# Altium schematic sheet Power Schematic.SchDoc
size A4; SheetNumber: 2; SheetTotal: 3
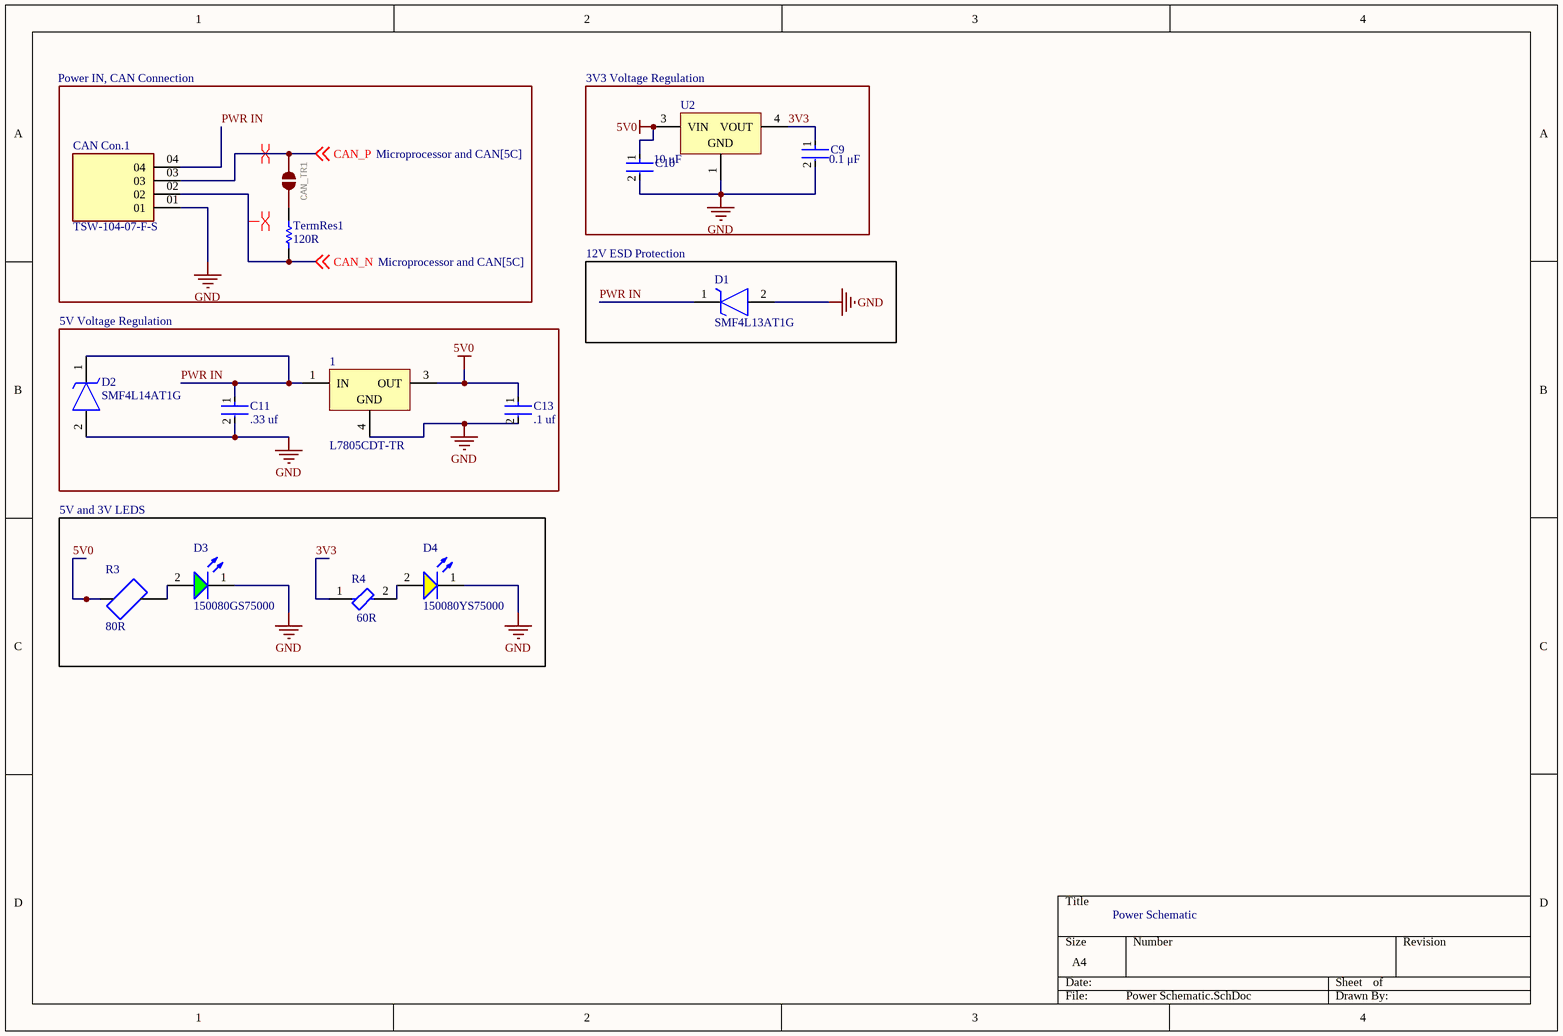
[diagram p0: Power Schematic.SchDoc]

## Parts
1  L7805CDT-TR  [TO-252_N]
C9  C0805C106K8PACTU  [FP-C0805C-DG-MFG]  (value not drawn)
C10  08051C104K4T2A  [FP-0805-L_2_01_0_2-W_1_25-IPC_B]  (value not drawn)
C11  .33 uf  [FP-GCJ219-0_3-IPC_A]
C13  .1 uf  [FP-0805-L_2_01_0_2-W_1_25-IPC_B]
CAN_Con.1  TSW-104-07-F-S  [SAMTEC_TSW-104-07-F-S]
CAN_TR1  (no value)  [SMT-JUMPER_2_NO_SILK]
D1  SMF4L13AT1G  [SODFL3619X98N]
D2  SMF4L14AT1G  [SODFL3619X98N]
D3  150080GS75000  [WL-SMCW_0805_150080xx75000]
D4  150080YS75000  [WL-SMCW_0805_150080xx75000]
R3  80R  [FB_HI0805R800R-10]
R4  60R  [FP-BLM21-0_2-t0_85-e0_5-d-IPC_A]
TermRes1  120R  [RESC2013X60X40LL20T25]
U2  LD1117ADT33TR  [TO-252_L]  (value not drawn)

## Blocks framed on the sheet
Power IN, CAN Connection: CAN_Con.1 CAN_TR1 TermRes1
12V ESD Protection: D1
5V Voltage Regulation: 1 C11 C13 D2
5V and 3V LEDS: D3 D4 R3 R4

## Nets
5V0: 1.3(OUT) C10.1 C13.1 R3.1 U2.3(VIN)
GND: 1.4(GND) C9.2 C10.2 C11.2 C13.2 CAN_Con.1.01 D1.2(A) D2.2(A) D3.1(K) D4.1(K) U2.1(GND)
3V3: C9.1 R4.1 U2.4(VOUT)
CAN_N: CAN_Con.1.02 TermRes1.1 ; off-sheet CAN_N
CAN_P: CAN_Con.1.03 CAN_TR1.1 ; off-sheet CAN_P
PWR IN: 1.1(IN) C11.1 CAN_Con.1.04 D1.1(K) D2.1(K)
NetCAN_TR1_2: CAN_TR1.2 TermRes1.2
NetD3_2: D3.2(A) R3.2
NetD4_2: D4.2(A) R4.2

## Layout directives
differential pair: CAN_N, CAN_P

## Notes on the sheet
- (near U2) 3V3 Voltage Regulation
- (near U2) 10 μF
- (near C9) 0.1 μF
- Power Schematic

## Library data of the parts
1 = CMP-0244-00216-1: Positive Voltage Regulator, 3-Pin DPAK, Tape and Reel; PackageVersion: 2011; PackageReference: TO-252; DatasheetVersion: 16/11/2011; PackageDescription: 3-Pin Transistor Outline Package 2.28 mm Pitch, 9.7 mm Lead Span (DPAK); ComponentLink1URL: http://www.st.com; ComponentLink2Description: Datasheet; ComponentLink1Description: Manufacturer URL; ComponentLink2URL: http://www.st.com/internet/com/TECHNICAL_RESOURCES/TECHNICAL_LITERATURE/DATASHEET/CD00000444.pdf
C9 = CMP-2007-03243-2: CAP CER 10UF 10V X5R 0805; Manufacturer: Kemet; 3DS Part Number: 220-00001; Tolerance: 10%; Temperature Coefficient: 15%; Material: Ceramic; Device Class L2: Capacitors; Device Class L1: Passive Components; ComponentLink2URL: https://content.kemet.com/datasheets/KEM_C1006_X5R_SMD.pdf; Height: 1.4mm; Lead Free: Yes; Manufacturer Part Number: C0805C106K8PACTU; Digikey Description: CAP CER 10UF 10V X5R 0805; Octopart: https://octopart.com/c0805c106k8pactu-kemet-98697; Capacitance: 10uF; Value: 10uF; Temperature Range Low: -55°C; Temperature: -55°C to +85°C; Automotive: No; Mouser Description: CAP CER 10UF 10V X5R 0805; Ipc Land Pattern Name: CAPC200125X125; Temperature Range High: +85°C; Voltage: 10V; RoHS: TRUE; Device Class L3: Ceramic Capacitors; ComponentLink2Description: Datasheet; Voltage Rating: 10V; Package: C0805C-DG; Temperature Characteristic: X5R; Category: Cap
C10 = CMP-2007-04172-2: Automotive Ceramic Capacitor, 0805, 100nF, 10%, X7R, 15%, 100V; Voltage Rating (DC): 100V; Case Code (Metric): 2012; Mount: Surface Mount; Length: 2.01mm; Depth: 1.25mm; Lead Free: Lead Free; Ratings: AEC-Q200; Max Operating Temperature: 125°C; Tolerance: 10%; Case/Package: 0805; Width: 0.049inch; Package Quantity: 1; Thickness: 0.055inch; Construction: Flat; Min Operating Temperature: -55°C; REACH SVHC: No SVHC; Number of Pins: 2; Radiation Hardening: No; Capacitance: 100nF; Voltage Rating: 100V; Height: 1.4mm; Series: -; Voltage: 100V; Dielectric: X7R; Termination: SMD/SMT; Case Code (Imperial): 0805; RoHS Compliant: Yes; Packaging: Tape and Reel; Dielectric Material: Ceramic
C11 = CMP-06035-047295-1: Cap Ceramic Multilayer 0.33uF 50VDC 10% SMD Paper T/R; Capacitance: 330nF; Voltage Rating (DC): 50V; Dielectric: X7R; Tolerance: 10%; Case/Package: 0805; Lead Free: Lead Free
C13 = CMP-2007-04174-2: General Purpose Ceramic Capacitor, 0805, 100nF, 10%, X7R, 15%, 100V; Packaging: Tape and Reel; Min Operating Temperature: -55°C; Dielectric Material: Ceramic; Height: 1.4mm; Voltage Rating: 100V; Termination: SMD/SMT; Case Code (Imperial): 0805; Case Code (Metric): 2012; Case/Package: 0805; Construction: Flat; Radiation Hardening: No; Series: -; Dielectric: X7R; Package Quantity: 2000; Mount: Surface Mount; Capacitance: 100nF; Contact Plating: Tin; Voltage: 100V; Lead Free: Lead Free; Depth: 1.25mm; RoHS Compliant: Yes; Number of Pins: 2; Max Operating Temperature: 125°C; Length: 2.01mm; Voltage Rating (DC): 100V; Thickness: 0.055inch; REACH SVHC: No SVHC; Width: 0.049inch; Tolerance: 10%
CAN_Con.1 = TSW-104-07-F-S: MF: Samtec; MP: TSW-104-07-F-S; Price: None; Package: None; Availability: Unavailable; Value: *; Supplier 1: Digikey; Supplier Part Number 1: MTSW-104-07-F-S-170-ND
CAN_TR1 = JUMPER-SMT_2_NO_SILK: GateName_1: G$1; SymbolName_1: SMT-JUMPER_2_NO; DeviceName: _SILK; LibraryName: SparkFun-Jumpers; DeviceSetName: JUMPER-SMT_2_NO; Package: SMT-JUMPER_2_NO_SILK
D1 = SMF4L13AT1G: TVS Diode (Uni-directional); Manufacturer_Name: LITTELFUSE; Datasheet Link: https://www.littelfuse.com/media?resourcetype=datasheets&itemid=f093622a-2591-4e70-85e6-32321d2f8c5a&filename=tvs-diode-smf4l-t1g-datasheet; Height: 0.98mm; Manufacturer_Part_Number: SMF4L13AT1G; Mouser Part Number: 576-SMF4L13AT1G; Mouser Price/Stock: https://www.mouser.co.uk/ProductDetail/Littelfuse/SMF4L13AT1G?qs=OcgtsXO%252B3gst%2FkI5Xf9O6g%3D%3D
D2 = SMF4L14AT1G: TVS Diode (Uni-directional); Manufacturer_Name: LITTELFUSE; Datasheet Link: https://www.littelfuse.com/media?resourcetype=datasheets&itemid=f093622a-2591-4e70-85e6-32321d2f8c5a&filename=tvs-diode-smf4l-t1g-datasheet; Height: 0.98mm; Manufacturer_Part_Number: SMF4L14AT1G; Mouser Part Number: 576-SMF4L14AT1G; Mouser Price/Stock: https://www.mouser.co.uk/ProductDetail/Littelfuse/SMF4L14AT1G?qs=OcgtsXO%252B3gvCCebw4hBNNg%3D%3D
D3 = CMP-1426-00007-3: WURTH ELEKTRONIK - 150080GS75000 - LED, Green, SMD, 0805, 30 mA, 3.2 V, 520 nm; Forward Voltage: 3.2V; Viewing Angle: 140°; Power Dissipation: 105mW; Peak Wavelength: 515nm; Max Reverse Voltage (DC): 5V; Luminous Intensity: 450mcd; Wavelength: 525nm; Max Junction Temperature (Tj): 95°C; Forward Current: 100mA; Test Current: 20mA; Lens Style: Clear, Rectangular; Length: 2mm; Case/Package: 0805; Case Code (Metric): 2012; Color: Green; Height: 700µm; Width: 1.25mm; Packaging: Tape and Reel; Mount: Surface Mount; REACH SVHC: Unknown; RoHS: Compliant; Min Operating Temperature: -40°C; Reverse Voltage: 5V; Max Operating Temperature: 85°C; Dominant Wavelength: 525nm; Case Code (Imperial): 0805
D4 = CMP-1426-00012-3: 2 V Yellow LED 2012 (0805) SMD, Wurth Elektronik WL-SMCW 150080YS75000; Dominant Wavelength: 590nm; Viewing Angle: 140°; Power Dissipation: 72mW; Peak Wavelength: 595nm; Lens Style: Clear, Rectangular; Max Junction Temperature (Tj): 95°C; Forward Voltage: 2V; Forward Current: 100mA; Luminous Intensity: 120mcd; Reverse Voltage: 5V; Test Current: 20mA; Case Code (Imperial): 0805; Color: Yellow; Width: 1.25mm; RoHS: Compliant; Min Operating Temperature: -40°C; Height: 700µm; Wavelength: 590nm; Length: 2mm; Case Code (Metric): 2012; Packaging: Tape and Reel; Mount: Surface Mount; REACH SVHC: Unknown; Case/Package: 0805; Max Operating Temperature: 85°C; Max Reverse Voltage (DC): 5V
R3 = HI0805R800R-10: MF: {'manufacturer': u'Laird-Signal Integrity Products'}; Package: None; Price: None; Value: *; MP: HI0805R800R-10; Availability: Unavailable
R4 = CMP-0686-00616-3: Chip Ferrite Bead, 0805, 60Ω @ 100MHz, 0.02Ω, 25%, 3.5A; DC Resistance-Max: 20mR; Number of Circuits: 1; DC Current: 3A; Shielding: Unshielded; Military Standard: Not; DC Resistance (DCR): 20mR; Core Material: Ferrite; Termination: SMD/SMT; Max Operating Temperature: 125°C; Max Current Rating: 3.5A; Length: 2mm; Packaging: Tape and Reel; Case Code (Metric): 2012; Series: BLM21P; REACH SVHC: No SVHC; Width: 1.25mm; Current Rating: 3.5A; Impedance: 60R; Height: 0.85mm; RoHS Compliant: Yes; Case Code (Imperial): 0805; Radiation Hardening: No; Frequency: 100MHz; Package Quantity: 1; Depth: 1.25mm; Tolerance: 25%; Number of Lines: 1; Lead Free: Lead Free; Case/Package: 0805; Min Operating Temperature: -55°C; Max DC Current: 3A; Material: Steel; Number of Pins: 2; Test Frequency: 100MHz
TermRes1 = CMP-2001-00645-1: Part Number: ERA6AEB473V; Manufacturer: Panasonic
U2 = CMP-0244-00137-1: 1A, Low Drop Positive Voltage Regulator, 3.3V, 3-Pin DPAK, Tape and Reel; ComponentLink2URL: http://www.st.com/internet/com/TECHNICAL_RESOURCES/TECHNICAL_LITERATURE/DATASHEET/CD00002116.pdf; ComponentLink2Description: Datasheet; ComponentLink1URL: http://www.st.com; PackageDescription: 3-Pin Transistor Outline Package 2.28 mm Pitch, 9.7 mm Lead Span (DPAK); ComponentLink1Description: Manufacturer URL; PackageVersion: 2011; PackageReference: TO-252; DatasheetVersion: 2/12/2011; Manufacturer PN: LD1117ADT33TR; Footprint 1: TO-252-3